# Altium schematic sheet FLS Hamamatsu_A.SchDoc
size B; Organization: Carnegie Institution of Washington; SheetNumber: 3; SheetTotal: 0; CompanyName: Carnegie Observatories; DrawnBy: alanb; Engineer: Alan Bagish; PageSetup: Record=PageOptions|CenterHorizontal=True|CenterVertical=True|PrintScale=0.70|XCorrection=1.00|YCorrection=1.00|PrintKind=0|BorderSize=5000000|LeftOffset=0|BottomOffset=0|Orientation=2|PaperLength=1000|PaperWidth=1000|Scale=100|PaperSource=259|PrintQuality=600|MediaType=1|DitherType=10|PaperKind=Letter|PrintScaleMode=1; DocumentName: Hamamatsu S10453-512Q
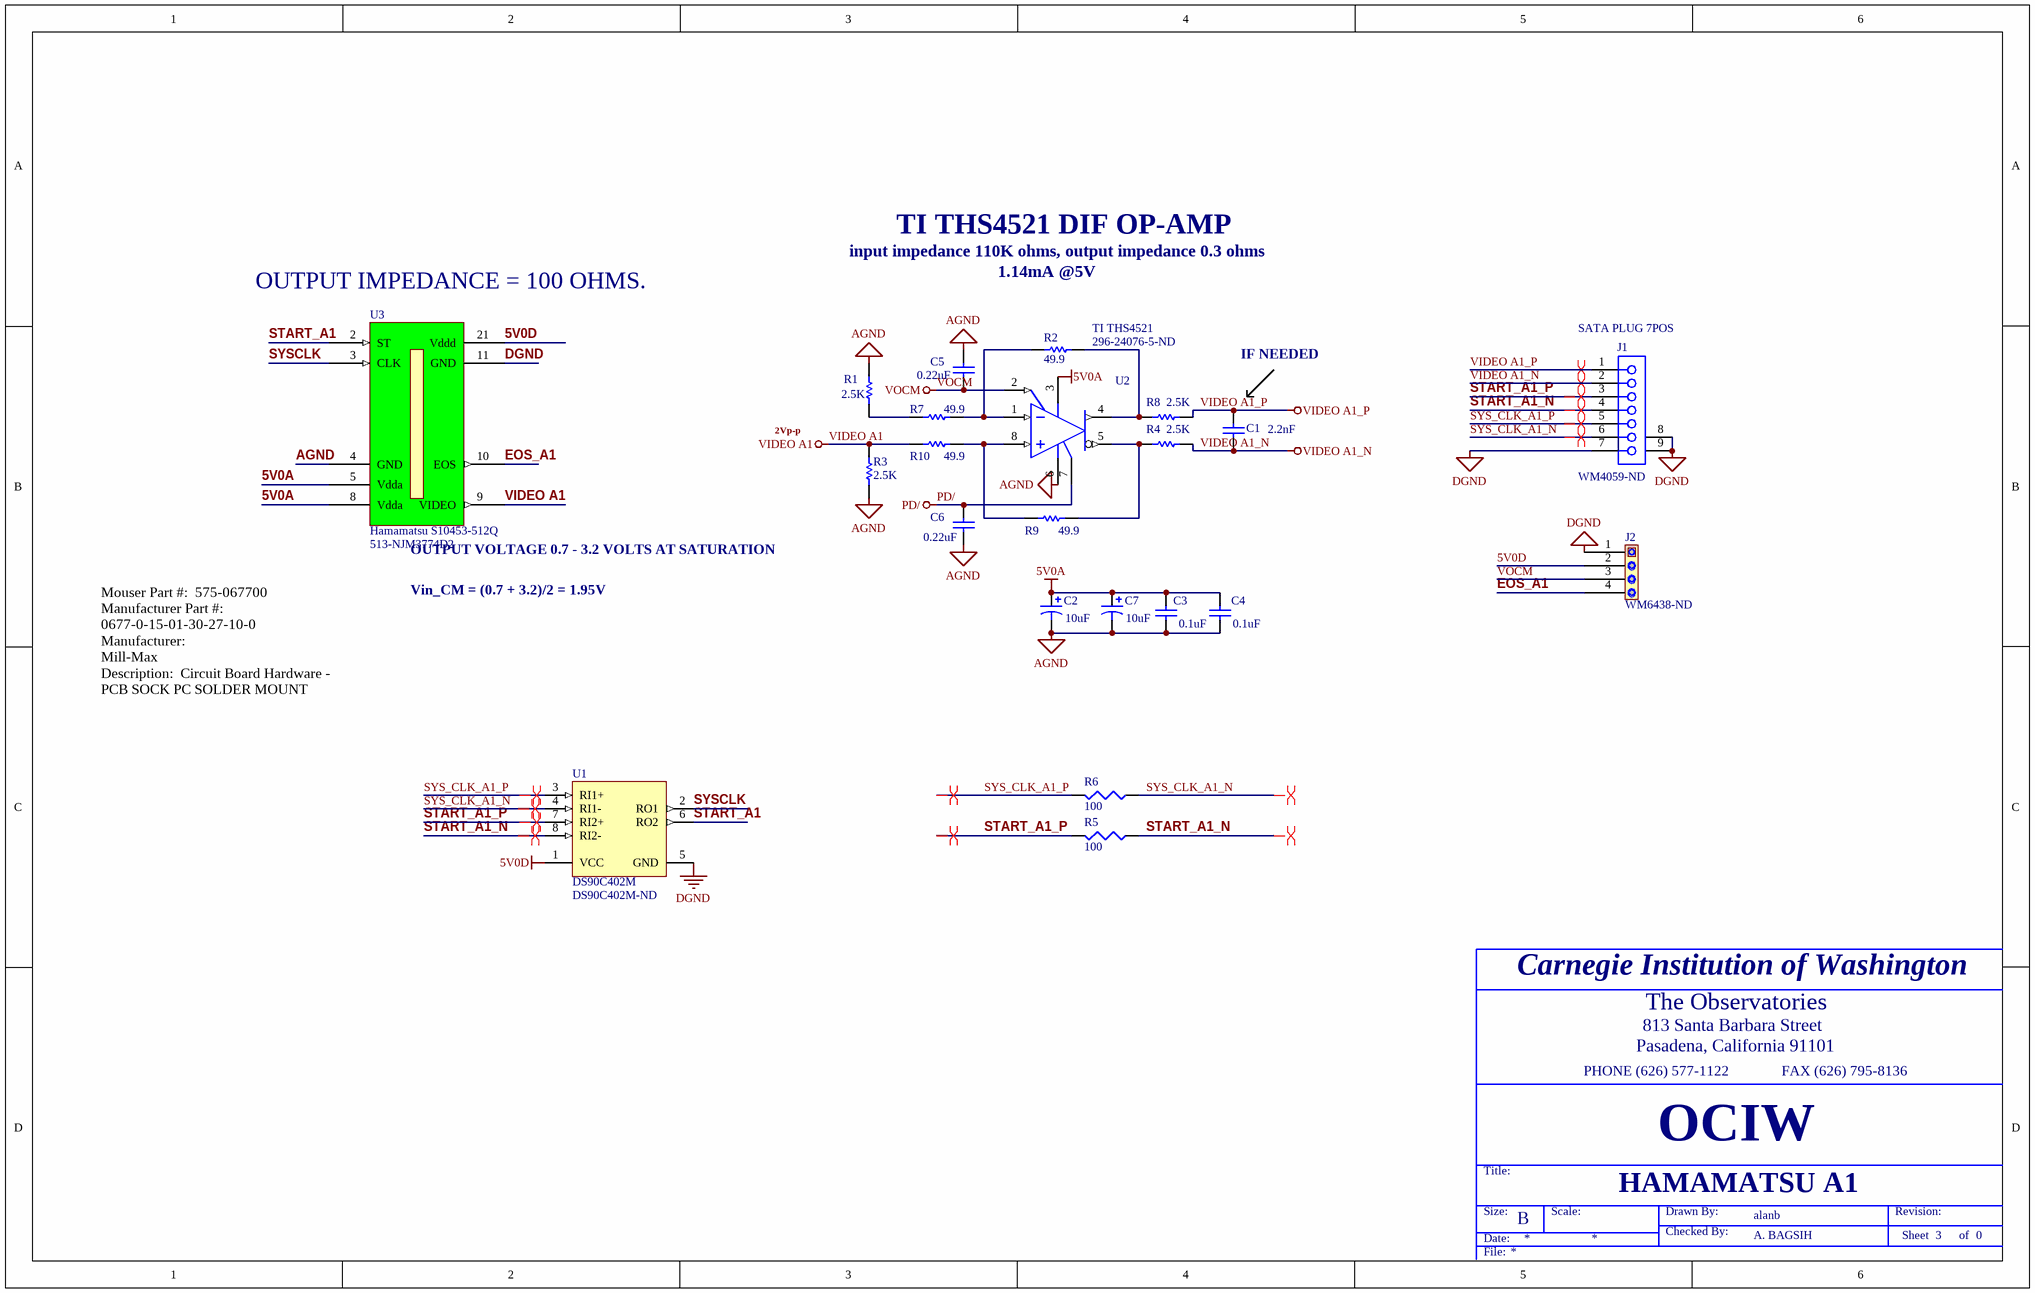
[diagram p0: FLS Hamamatsu_A.SchDoc]

## Parts
C1  value 2.2nF  [0805 SLIM]  (hidden comment: Cap)
C2  value 10uF  [1206]  (hidden comment: Cap Pol3)
C3  value 0.1uF  [0805 SLIM]  (hidden comment: Cap)
C4  value 0.1uF  [0805 SLIM]  (hidden comment: Cap)
C5  value 0.22uF  [0805 SLIM]  (hidden comment: Cap)
C6  value 0.22uF  [0805 SLIM]  (hidden comment: Cap)
C7  value 10uF  [1206]  (hidden comment: Cap Pol3)
J1  SATA PLUG 7POS  Supplier Part Number 1: WM4059-ND  [Molex 471554001]
J2  Supplier Part Number 1: WM6438-ND  [SIP4]  (hidden comment: CON4)
R1  value 2.5K  [0805 SLIM]  (hidden comment: Res1)
R2  49.9  [0805 SLIM]
R3  value 2.5K  [0805 SLIM]  (hidden comment: Res1)
R4  value 2.5K  [0805 SLIM]  (hidden comment: Res1)
R5  100  [0402 slim]
R6  100  [0402 SLIM]
R7  49.9  [0805 SLIM]
R8  value 2.5K  [0805 SLIM]  (hidden comment: Res1)
R9  49.9  [0805 SLIM]
R10  49.9  [0805 SLIM]
U1  DS90C402M  Supplier Part Number 1: DS90C402M-ND  [M08A_N]
U2  TI THS4521  Supplier Part Number 1: 296-24076-5-ND  [MSOP8]
U3  Hamamatsu S10453-512Q  Supplier Part Number 1: 513-NJM3774D2  [Hamamatsu 22]

## Nets
5V0A: C2.1 C3.2 C4.2 C7.1 U2.3(V+) U3.5(Vdda) U3.8(Vdda)
5V0D: J2.2 U1.1(VCC) U3.21(Vddd)
AGND: C2.2 C3.1 C4.1 C5.2 C6.1 C7.2 R1.1 R3.2 U2.6(V-) U3.4(GND)
DGND: J1.7 J1.8(MH1) J1.9(MH2) J2.1 U1.5(GND) U3.11(GND)
PD/: C6.2 U2.7(PD/)
VIDEO A1: R3.1 R10.1 U3.9(VIDEO)
VIDEO A1_N: C1.1 J1.2 R4.1
VIDEO A1_P: C1.2 J1.1 R8.1
VOCM: C5.1 J2.3 U2.2(Vocm)
EOS_A1: J2.4 U3.10(EOS)
START_A1: U1.6(RO2) U3.2(ST)
START_A1_N: J1.4 R5.1 U1.8(RI2-)
START_A1_P: J1.3 R5.2 U1.7(RI2+)
SYS_CLK_A1_N: J1.6 R6.1 U1.4(RI1-)
SYS_CLK_A1_P: J1.5 R6.2 U1.3(RI1+)
SYSCLK: U1.2(RO1) U3.3(CLK)
NetR1_2: R1.2 R7.1
NetR2_1: R2.1 R7.2 U2.1(IN-)
NetR2_2: R2.2 R8.2 U2.4(Q)
NetR4_2: R4.2 R9.2 U2.5(~{Q})
NetR9_1: R9.1 R10.2 U2.8(IN+)

## Layout directives
differential pair: START_A1_N, START_A1_P, SYS_CLK_A1_N, SYS_CLK_A1_P, VIDEO A1_N, VIDEO A1_P

## Notes on the sheet
- TI THS4521 DIF OP-AMP
- (near U3) OUTPUT IMPEDANCE = 100 OHMS.
- input impedance 110K ohms, output impedance 0.3 ohms
- 1.14mA @5V
- IF NEEDED
- 2Vp-p
- (near U3) OUTPUT VOLTAGE 0.7 - 3.2 VOLTS AT SATURATION
- Vin_CM = (0.7 + 3.2)/2 = 1.95V
- Mouser Part #: 	575-067700
  Manufacturer Part #:
  0677-0-15-01-30-27-10-0
  Manufacturer:
  Mill-Max
  Description: 	Circuit Board Hardware - PCB SOCK PC SOLDER MOUNT
- HAMAMATSU A1
- Carnegie Institution of Washington
- 813 Santa Barbara Street
- The Observatories
- PHONE (626) 577-1122               FAX (626) 795-8136
- Pasadena, California 91101
- Title:
- OCIW
- Size:
- Date:
- B
- Scale:
- Drawn By:
- Checked By:
- A. BAGSIH
- alanb
- Revision:
- Sheet          of
- File:

## Library data of the parts
C1 = Cap: Capacitor; Published: 8-Jun-2000; LatestRevisionDate: 17-Jul-2002; LatestRevisionNote: Re-released for DXP Platform.; PackageReference: RAD-0.3; Publisher: Altium Limited
C2 C7 = Cap Pol3: Polarized Capacitor (Surface Mount); Kemet: T491A106M016AT; Description: CAP TANT 10UF 16V 20% 1206; Published: 8-Jun-2000; LatestRevisionDate: 29-May-2009; PackageReference: C0805; Publisher: Altium Limited; PackageDescription: Chip Capacitor; Digi-Key: 399-3687-6-ND
C3 C4 = Cap: Capacitor; Murata Electronics North America: GRM216F51E104ZA01D; Published: 8-Jun-2000; LatestRevisionDate: 17-Jul-2002; LatestRevisionNote: Re-released for DXP Platform.; PackageReference: RAD-0.3; Publisher: Altium Limited; Digi-Key: 490-1726-2-ND; Footprint: 0805
C5 C6 = Cap: Capacitor; Taiyo Yuden: UMK212B7224KG-T; Description: CAP CER 0.22UF 50V 10% X7R 0805; Published: 8-Jun-2000; LatestRevisionDate: 17-Jul-2002; LatestRevisionNote: Re-released for DXP Platform.; PackageReference: 0805 (2012 Metric); Publisher: Altium Limited; Digi-Key Part Number: 587-1287-6-ND
J1 = CL586-0535-5: FH12 Series, "Flip-Lock" SMT/ZIF FFC/FPC Connector - 1.0mm Spaced Bottom Standard Contact; Manufacturer: Molex Inc; Positions: 7; PackageReference: 67800-8005; Publisher: Altium Limited; DIGI-KEY: WM19103-ND; ComponentLink1Description: CONN HEADER 7POS VERT DIP 15GOLD; ComponentLink1URL: http://search.digikey.com/us/en/products/0470804001/WM4279DKR-ND/2498885; Supplier 1: Digi-Key
J2 = CON3: Supplier 1: Digi-Key
R1 R3 R4 R8 = Res1: Resistor; KOA Speer: RN732ATTD2501B25; Description: Thin Film Resistors - SMD 1/10W 2.5Kohm 0.1% 25ppm; Tolerance: 0.1 %; Temperature Coefficient: 25 PPM / C; Published: 8-Jun-2000; LatestRevisionDate: 17-Jul-2002; LatestRevisionNote: Re-released for DXP Platform.; PackageReference: 0805 (2012 metric); Publisher: Altium Limited; MOUSER: 660-RN732ATTD2501B25
R2 R7 R9 R10 = Res1: Resistor; TE Connectivity: 1676703-2; Description: RES 49.9 OHM 1/10W 0.1% 0805; Temperature Coefficient: ±10ppm/°C; Tolerance: ±0.1%; Published: 8-Jun-2000; LatestRevisionDate: 17-Jul-2002; LatestRevisionNote: Re-released for DXP Platform.; PackageReference: 0805 (2012 Metric); Publisher: Altium Limited; Value: 49.9; DIGI-KEY: A103455DKR-ND
R5 R6 = RES1
U1 = DS90C402M: Dual Low Voltage Differential Signaling (LVDS) Receiver, 8-pin Narrow SOIC; Manufacturer: National Semiconductor; PackageTopMarking: NSZXTT*DS90C*402M; PowerWise: N; CompType: Interface IC; Published: 4-Dec-2008; DatasheetVersion: Aug-2005; PackageVersion: revM, May-2009; PackageReference: M08A; Publisher: Altium Limited; PackageDescription: SOIC Narrow, 4.9 x 3.9 x 1.45mm, 8 Lead, 1.27mm Pitch; Supplier 1: Digi-Key; PartNumber: DS90C402M; RoHS: N; PinCount: 8; Code_JEDEC: MS-012-AA; Code_IPC: SOIC127P600-8; ComponentLink1Description: DS90C402 Datasheet; ComponentLink1URL: http://www.national.com/ds/DS/DS90C402.pdf; ComponentLink2Description: DS90C402 Web Page; ComponentLink2URL: http://www.national.com/pf/DS/DS90C402.html; ComponentLink3Description: M08A Package Page; ComponentLink3URL: http://www.national.com/packaging/folders/m08a.html
U2 = TI THS4521: MANUFACTURER: TEXAS INSTRUMENTS; MANUFACTURER #: THS4521IDGKT; VCC: 2.5V TO 5.5V; VENDOR: DIGI-KEY; DESCRIPTION: IC OPAMP DIFF R-R 145MHZ 8MSOP; Data Sheet: TI Op-Amp ths4521.pdf; DIGI-KEY PART NUMBER: 296-24077-6-ND; Supplier 1: Digi-Key
U3 = Hamamatsu: Linear Image Sensor; Supplier 1: Mouser